# EAGLE schematic tentacle_module (EAGLE 7.0.0)
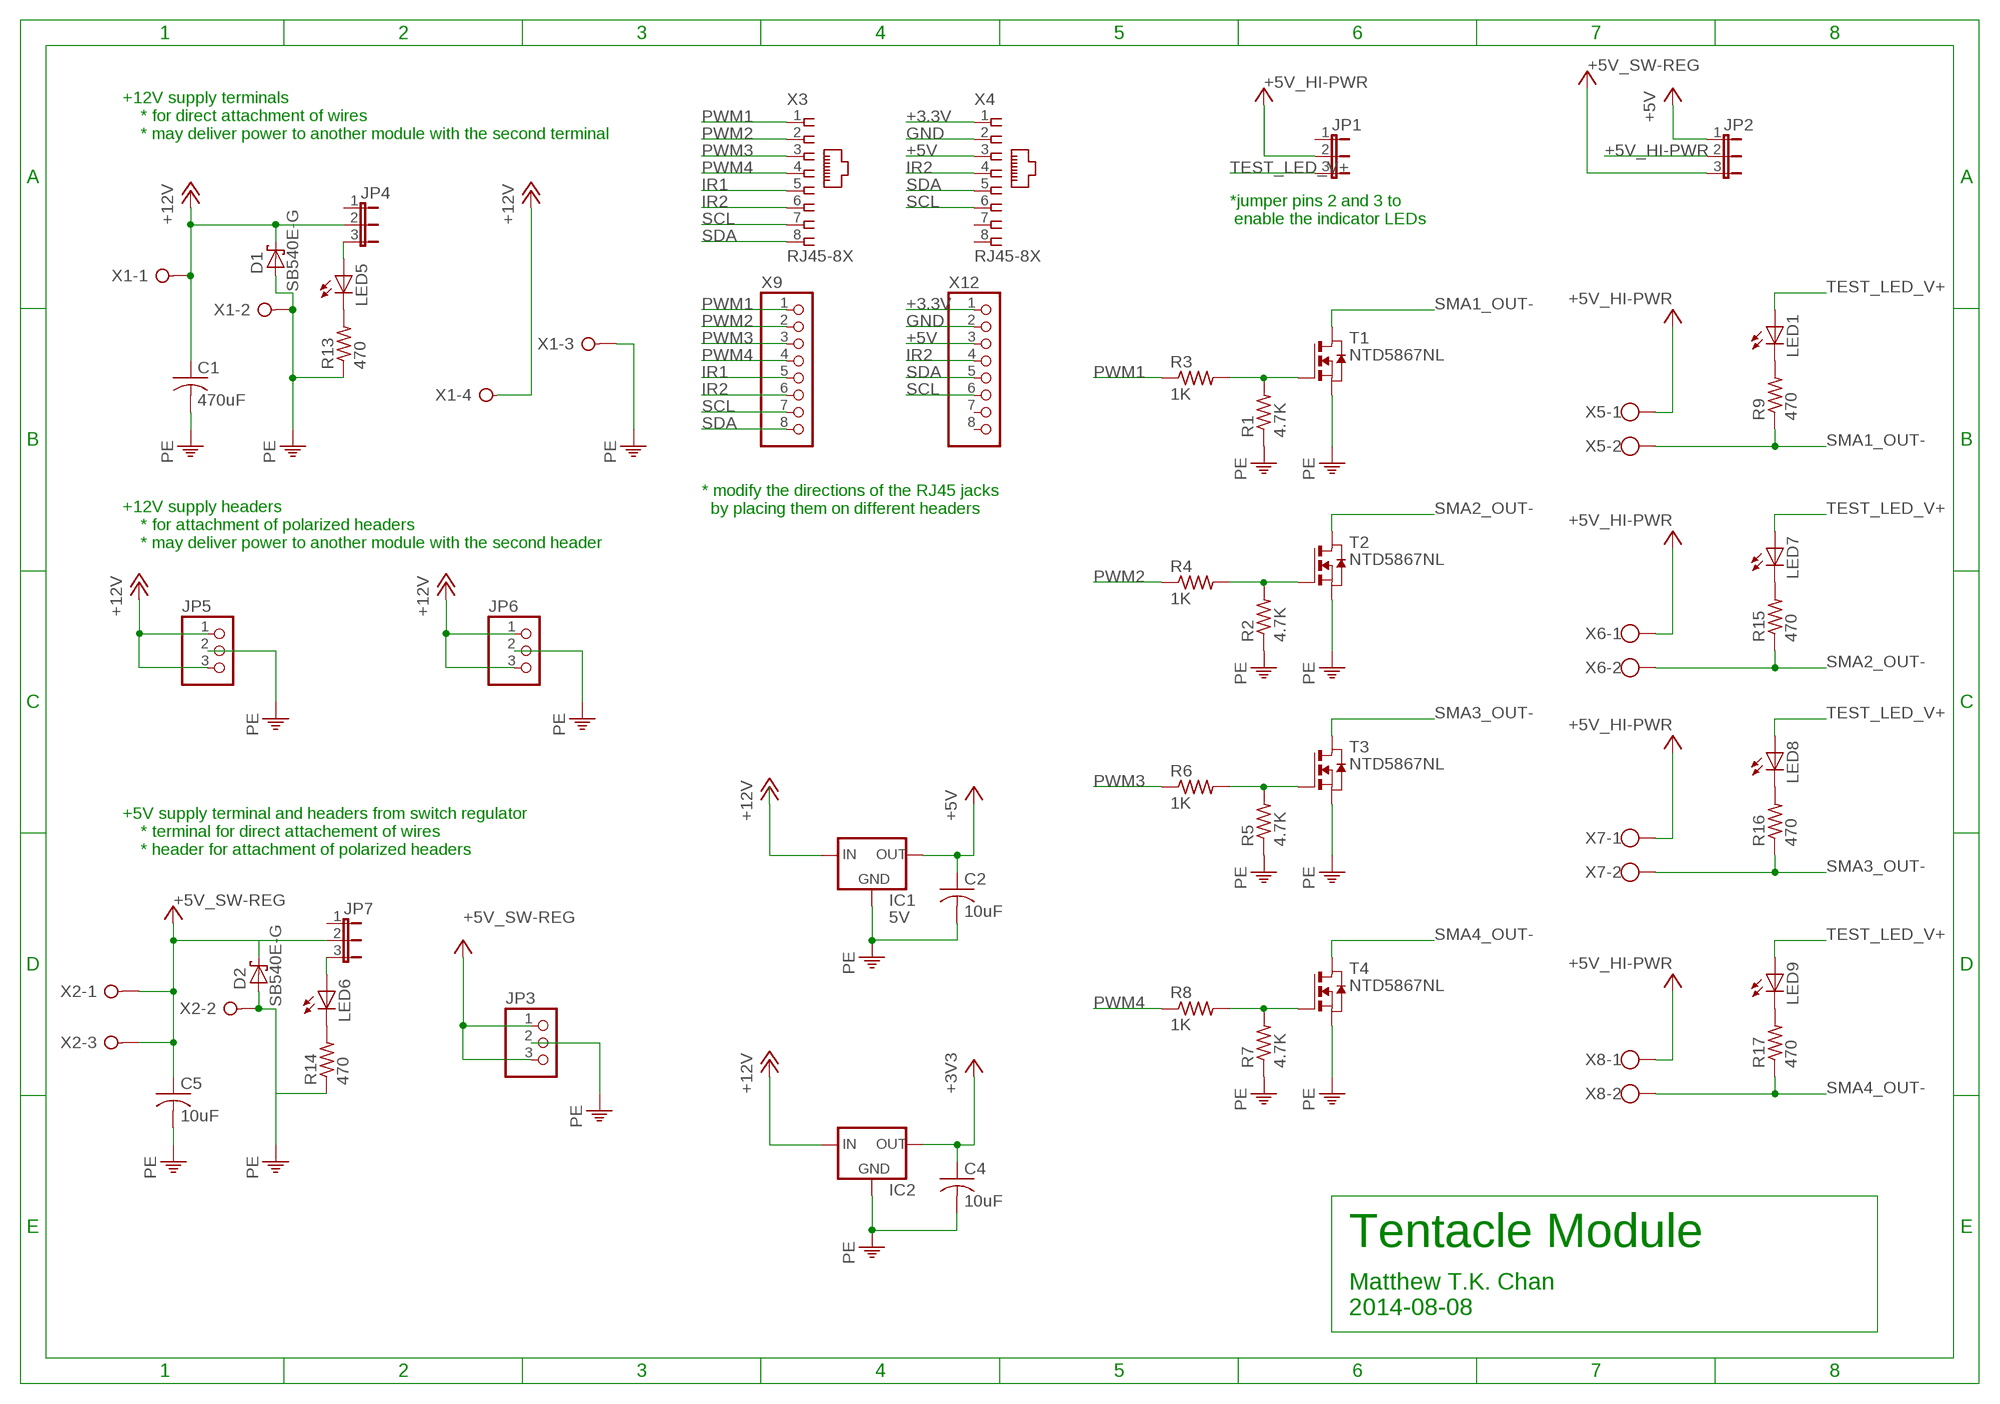
[diagram p0: schematic, sheet 1]

## Parts
C1  470uF  C-USC1206  [C1206]
C2  10uF  C-USC1206  [C1206]
C4  10uF  C-USC1206  [C1206]
C5  10uF  C-USC1206  [C1206]
D1  SB540E-G  [DO201T15]
D2  SB540E-G  [DO201T15]
IC1  5V  78XXSHORIZONTAL  [TO220L1]
IC2  78XXSHORIZONTAL  [TO220L1]
JP1  JP2E  [JP2]
JP2  JP2E  [JP2]
JP3  PINHD-1X3/90  [1X03/90]
JP4  JP2E  [JP2]
JP5  PINHD-1X3/90  [1X03/90]
JP6  PINHD-1X3/90  [1X03/90]
JP7  JP2E  [JP2]
LED1  LEDSML1206  [SML1206]
LED5  LEDSML1206  [SML1206]
LED6  LEDSML1206  [SML1206]
LED7  LEDSML1206  [SML1206]
LED8  LEDSML1206  [SML1206]
LED9  LEDSML1206  [SML1206]
R1  4.7K  R-US_R1206  [R1206]
R2  4.7K  R-US_R1206  [R1206]
R3  1K  R-US_R1206  [R1206]
R4  1K  R-US_R1206  [R1206]
R5  4.7K  R-US_R1206  [R1206]
R6  1K  R-US_R1206  [R1206]
R7  4.7K  R-US_R1206  [R1206]
R8  1K  R-US_R1206  [R1206]
R9  470  R-US_R1206  [R1206]
R13  470  R-US_R1206  [R1206]
R14  470  R-US_R1206  [R1206]
R15  470  R-US_R1206  [R1206]
R16  470  R-US_R1206  [R1206]
R17  470  R-US_R1206  [R1206]
T1  NTD5867NL  NTD5867NLT4G  [DPACK]
T2  NTD5867NL  NTD5867NLT4G  [DPACK]
T3  NTD5867NL  NTD5867NLT4G  [DPACK]
T4  NTD5867NL  NTD5867NLT4G  [DPACK]
X1  W237-04P  [W237-4P]
X2  W237-03P  [W237-133]
X3  RJ45-8X  [RJ45-NO-SHIELD]
X4  RJ45-8X  [RJ45-NO-SHIELD]
X5  W237-102  [W237-102]
X6  W237-102  [W237-102]
X7  W237-102  [W237-102]
X8  W237-102  [W237-102]
X9  PINHD-1X8/90  [1X08/90]
X12  PINHD-1X8/90  [1X08/90]

## Nets
+3.3V: X4.1 X12.1
+3V3: C4.1 IC2.3(OUT)
+5V: C2.1 IC1.3(OUT) JP1.2 JP2.1 JP2.3 X4.3 X12.3 ; supply symbol labelled +5V_SW-REG, +5V_HI-PWR
+5V_HI-PWR: JP2.2 X5.1 X6.1 X7.1 X8.1
+5V_SW-REG: C5.1 D2.C JP3.1 JP3.3 X2.1 X2.3
+12V: C1.1 D1.C IC1.1(IN) IC2.1(IN) JP4.2 JP5.1 JP5.3 JP6.1 JP6.3 X1.1
+12V1: JP7.2
GND: C1.2 C2.2 C4.2 C5.2 D1.A D2.A IC1.2(GND) IC2.2(GND) JP3.2 JP5.2 JP6.2 R1.1 R2.1 R5.1 R7.1 R13.1 T1.3(S) T2.3(S) T3.3(S) T4.3(S) X1.2 X1.3 X2.2 X4.2 X12.2 ; supply symbol labelled PE
GND1: R14.1
IR1: X3.5 X9.5
IR2: X3.6 X4.4 X9.6 X12.4
N$1: R2.2 R4.2 T2.1(G)
N$2: R5.2 R6.2 T3.1(G)
N$3: R7.2 R8.2 T4.1(G)
N$4: R1.2 R3.2 T1.1(G)
N$5: LED1.C R9.2
N$10: LED5.C R13.2
N$11: JP4.3 LED5.A
N$12: LED6.C R14.2
N$13: JP7.3 LED6.A
N$14: LED7.C R15.2
N$15: LED8.C R16.2
N$16: LED9.C R17.2
PWM1: R3.1 X3.1 X9.1
PWM2: R4.1 X3.2 X9.2
PWM3: R6.1 X3.3 X9.3
PWM4: R8.1 X3.4 X9.4
SCL: X3.7 X4.6 X9.7 X12.6
SDA: X3.8 X4.5 X9.8 X12.5
SMA1_OUT-: R9.1 T1.2(D) X5.2
SMA2_OUT-: R15.1 T2.2(D) X6.2
SMA3_OUT-: R16.1 T3.2(D) X7.2
SMA4_OUT-: R17.1 T4.2(D) X8.2
TEST_LED_V+: JP1.3 LED1.A LED7.A LED8.A LED9.A
Unconnected: JP1.1 JP4.1 JP7.1 X1.4 X4.7 X4.8 X12.7 X12.8

## Notes on the sheet
- +12V supply terminals
      * for direct attachment of wires
      * may deliver power to another module with the second terminal
- *jumper pins 2 and 3 to
   enable the indicator LEDs
- * modify the directions of the RJ45 jacks 
    by placing them on different headers
- +12V supply headers
      * for attachment of polarized headers
      * may deliver power to another module with the second header
- +5V supply terminal and headers from switch regulator
      * terminal for direct attachement of wires
      * header for attachment of polarized headers
- Tentacle Module
- Matthew T.K. Chan
  2014-08-08

## Library data of the parts
C1 C2 C4 C5 = rcl:C-US: CAPACITOR, American symbol
D1 D2 = CBLA_Test_bed_Library:SB540E-G: SCHOTTKY BARRIER RECTIFIER 3.0 AMPERES 20, 30, 40 VOLT Source: MBRS340T3-D.pdf
IC1 IC2 = CBLA_Test_bed_Library:78XXS: VOLTAGE REGULATOR
JP1 JP2 JP4 JP7 = jumper:JP2E: JUMPER
JP3 JP5 JP6 = pinhead:PINHD-1X3: PIN HEADER
LED1 LED5-LED9 = led:LED: LED OSRAM: - CHIPLED LG R971, LG N971, LY N971, LG Q971, LY Q971, LO R971, LY R971 LH N974, LH R974 LS Q976, LO Q976, LY Q976 LO Q996 - Hyper CHIPLED LW Q18S LB Q993, LB Q99A, LB R99A - SideLED LS A670, LO A670, LY A670, LG A670, LP A670 LB A673, LV A673, LT A673, LW A673 LH A674 LY A675 LS A676, LA A676, LO A676, LY A676, LW A676 LS A679, LY A679, LG A679 - Hyper Micro SIDELED® LS Y876, LA Y876, LO Y876, LY Y876 LT Y87S - SmartLED LW L88C, LW L88S LB L89C, LB L89S, LG L890 LS L89K, LO L89K, LY L89K LS L896, LA L896, LO L896, LY L896 - TOPLED LS T670, LO T670, LY T670, LG T670, LP T670 LSG T670, LSP T670, LSY T670, LOP T670, LYG T670 LG T671, LOG T671, LSG T671 LB T673, LV T673, LT T673, LW T673 LH T674 LS T676, LA T676, LO T676, LY T676, LB T676, LH T676, LSB T676, LW T676 LB T67C, LV T67C, LT T67C, LS T67K, LO T67K, LY T67K, LW E67C LS E67B, LA E67B, LO E67B, LY E67B, LB E67C, LV E67C, LT E67C LW T67C LS T679, LY T679, LG T679 LS T770, LO T770, LY T770, LG T770, LP T770 LB T773, LV T773, LT T773, LW T773 LH T774 LS E675, LA E675, LY E675, LS T675 LS T776, LA T776, LO T776, LY T776, LB T776 LHGB T686 LT T68C, LB T68C - Hyper Mini TOPLED® LB M676 - Mini TOPLED Santana® LG M470 LS M47K, LO M47K, LY M47K Source: http://www.osram.convergy.de LUXEON: - LUMILED® LXK2-PW12-R00, LXK2-PW12-S00, LXK2-PW14-U00, LXK2-PW14-V00 LXK2-PM12-R00, LXK2-PM12-S00, LXK2-PM14-U00 LXK2-PE12-Q00, LXK2-PE12-R00, LXK2-PE12-S00, LXK2-PE14-T00, LXK2-PE14-U00 LXK2-PB12-K00, LXK2-PB12-L00, LXK2-PB12-M00, LXK2-PB14-N00, LXK2-PB14-P00, LXK2-PB14-Q00 LXK2-PR12-L00, LXK2-PR12-M00, LXK2-PR14-Q00, LXK2-PR14-R00 LXK2-PD12-Q00, LXK2-PD12-R00, LXK2-PD12-S00 LXK2-PH12-R00, LXK2-PH12-S00 LXK2-PL12-P00, LXK2-PL12-Q00, LXK2-PL12-R00 Source: www.luxeon.com KINGBRIGHT: KA-3528ASYC Source: www.kingbright.com
R1-R9 R13-R17 = rcl:R-US_: RESISTOR, American symbol
T1-T4 = CBLA_Test_bed_Library:NTD5867NL: MOS FET
X1 = con-wago-508:W237-04P: WAGO SREW CLAMP; OC_FARNELL: unknown; OC_NEWARK: unknown
X2 = con-wago-508:W237-03P: WAGO SREW CLAMP; OC_FARNELL: unknown; OC_NEWARK: unknown
X3 X4 = CBLA_Test_bed_Library:RJ45: CORCOM Modular RJ Jacks No Shield Source: www.tycoelectronics.com .. ENG_DS_1654001_1099_RJ_L_0507.pdf; MPN: RJ45-8X; OC_FARNELL: unknown; OC_NEWARK: 16R6101
X5-X8 = con-wago-500:W237-102: WAGO SCREW CLAMP; MPN: 237-102; OC_FARNELL: unknown; OC_NEWARK: 70K9898
X9 X12 = pinhead:PINHD-1X8: PIN HEADER